# EAGLE board n64adv2 (EAGLE 9.1.3)
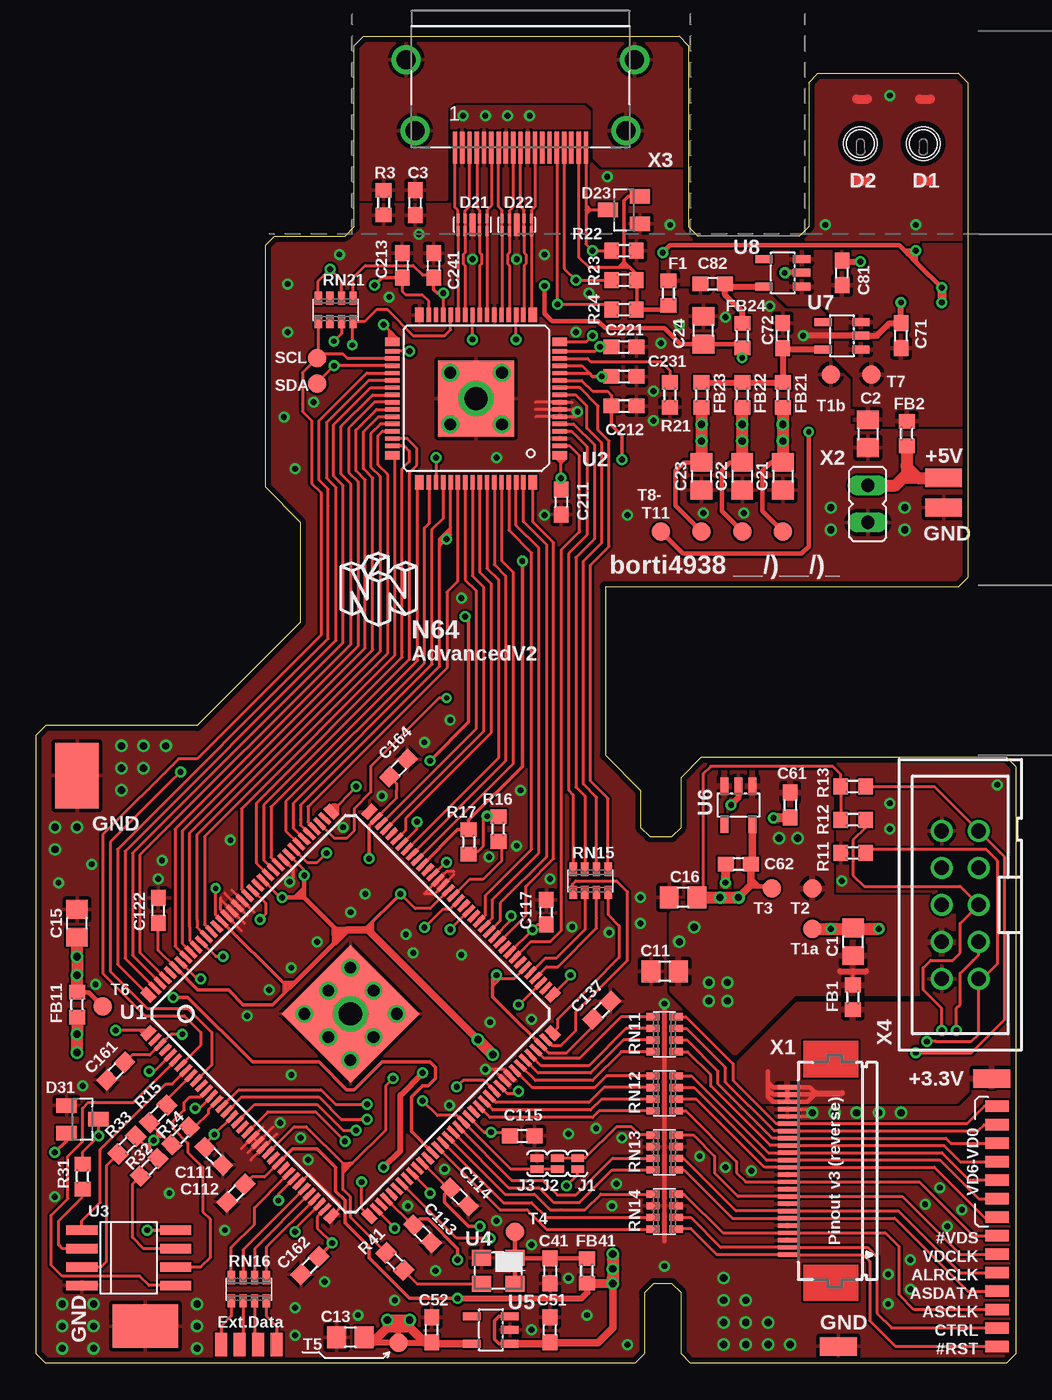
[diagram p4: board, top side]
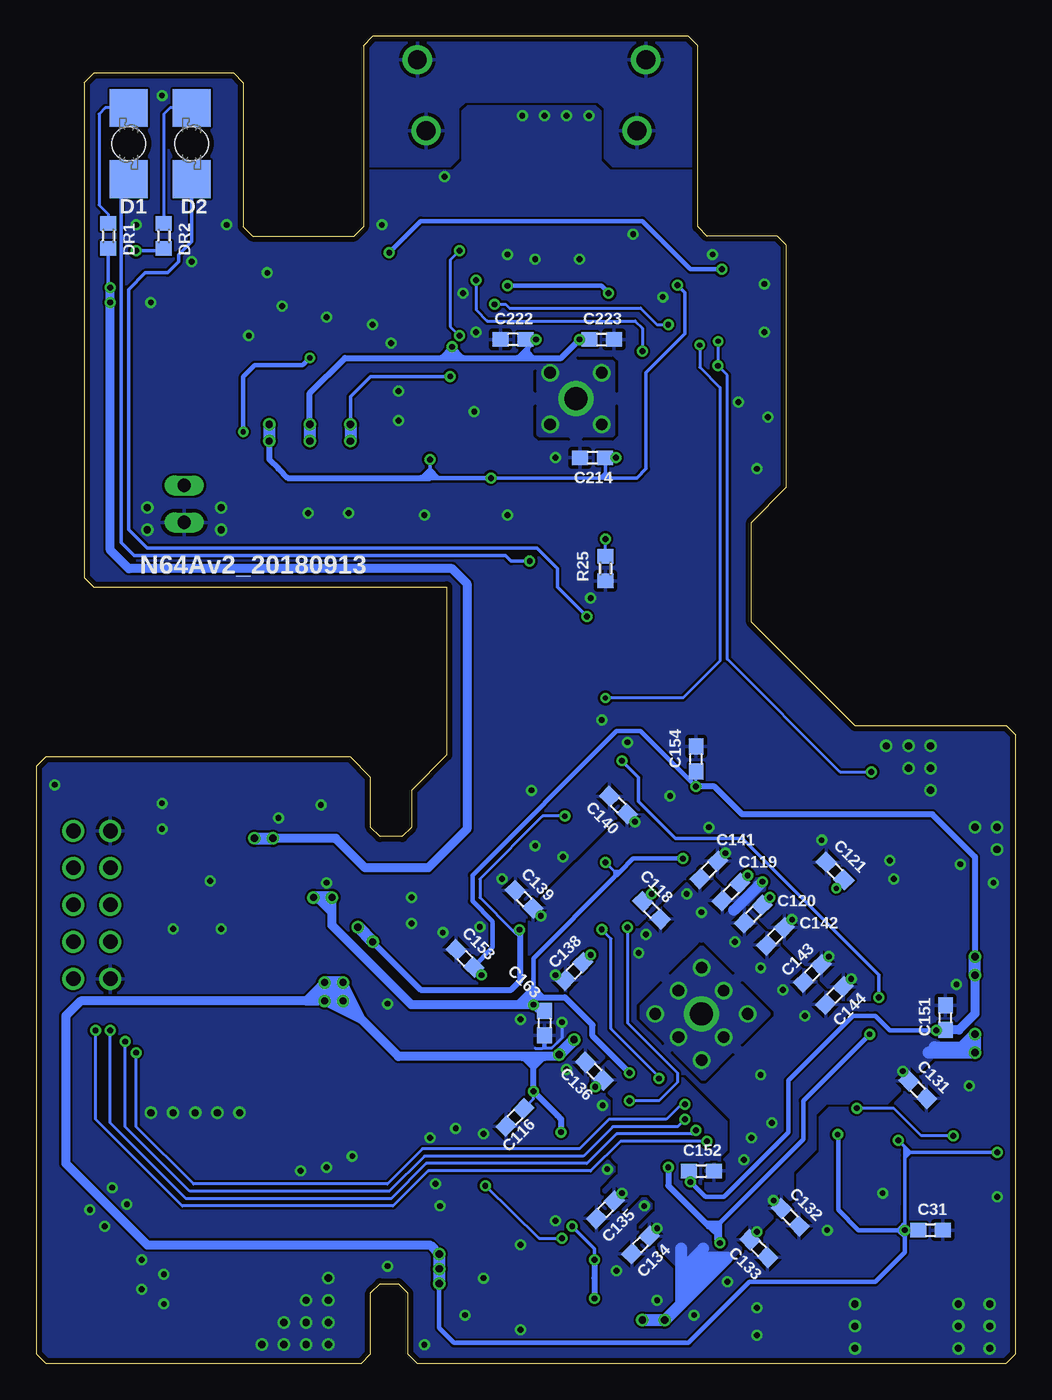
[diagram p5: board, bottom side, seen from below]

Size 67.31 x 91.19 mm. Coordinates in mm from the lower left corner, seen from the top.
Outline: 41.15,0 0.64,0 0,0.64 0,43.18 0.64,43.81 11.05,43.81 18.16,50.93 18.16,57.78 15.75,60.2 15.75,76.83 16.38,77.47 21.21,77.47 21.84,78.11 21.84,90.55 22.48,91.19 44.2,91.19 44.83,90.55 44.83,78.11 45.47,77.47 52.45,77.47 53.09,78.11 53.09,88.01 53.72,88.65 63.37,88.65 64.01,88.01 64.01,53.98 63.37,53.34 39.12,53.34 39.12,41.78 41.53,39.37 41.53,36.83 42.16,36.2 43.69,36.2 44.32,36.83 44.32,40.26 45.72,41.66 66.67,41.66 67.31,41.02 67.31,0.64 66.67,0 44.96,0 44.32,0.64 44.32,4.83 43.69,5.46 42.42,5.46 41.78,4.83 41.78,0.64 41.15,0
Copper layers (1*16): Top 0.0356mm / dielectric 1.5011mm / Bottom 0.0356mm
Design rules "LaenPCBOrder": minimum track width 6mil, minimum drill 13mil, track to track 6mil, track to pad 6mil, pad to pad 6mil, via to via 6mil, smd to smd 6mil, copper to edge 15mil, drill to drill 6mil, minimum pad ring 7mil, minimum via ring 7mil, stop-mask expansion 3mil, vias tented up to drill 30mil, thermal gap 10mil
bRestrict: 22 lines

## Footprints (pad centres in the part's own frame; a part is rotated, then mirrored left to right if it is on the bottom)
SMD1,27-2,54 = smd 1.27 x 2.54: 1 0,0
SMD0,8-1,6 = smd 0.8 x 1.6: P$1 0,0
C0805 = smd 1.3 x 1.5: 1 -0.95,0; 2 0.95,0
C0603 = smd 1.1 x 1: 1 -0.85,0; 2 0.85,0
P47F-BOTTOM = smd 2.6 x 2.6: A -2.45,0; C 2.45,0 | hole 2.3: 0,0
HDMI_RCLAMP = smd 0.2 x 0.675: 1 -1,-0.438; 2 -0.5,-0.438; 4 0.5,-0.438; 5 1,-0.438; 6 1,0.438; 7 0.5,0.438; 9 -0.5,0.438; 10 -1,0.438 | smd 0.4 x 1.55: 3 0,0
SOT23 = smd 1 x 1.4: 1 -0.95,-1.1; 2 0.95,-1.1; 3 0,1.1
R0603 = smd 1 x 1.1: 1 -0.85,0; 2 0.85,0
SJ_SMALL = smd 0.508 x 0.889: 1 -0.381,0; 2 0.381,0
CTS742C083 = smd 0.5 x 0.9: 1 -1.2,-0.8; 2 -0.4,-0.8; 3 0.4,-0.8; 4 1.2,-0.8; 5 1.2,0.8; 6 0.4,0.8; 7 -0.4,0.8; 8 -1.2,0.8
GND_FINGER_PAD = smd 4.5 x 3: P$1 0,0
B1,27 = smd 1.27 x 1.27: TP 0,0
EQFP144_2 = smd 1 x 0.6: 1 -10.75,8.9; 36 -10.75,-8.9; 73 10.75,-8.9; 108 10.75,8.9 | smd 1 x 0.3: 2 -10.75,8.25; 3 -10.75,7.75; 4 -10.75,7.25; 5 -10.75,6.75; 6 -10.75,6.25; 7 -10.75,5.75; 8 -10.75,5.25; 9 -10.75,4.75; 10 -10.75,4.25; 11 -10.75,3.75; 12 -10.75,3.25; 13 -10.75,2.75; 14 -10.75,2.25; 15 -10.75,1.75; 16 -10.75,1.25; 17 -10.75,0.75; 18 -10.75,0.25; 19 -10.75,-0.25; 20 -10.75,-0.75; 21 -10.75,-1.25; 22 -10.75,-1.75; 23 -10.75,-2.25; 24 -10.75,-2.75; 25 -10.75,-3.25; 26 -10.75,-3.75; 27 -10.75,-4.25; 28 -10.75,-4.75; 29 -10.75,-5.25; 30 -10.75,-5.75; 31 -10.75,-6.25; 32 -10.75,-6.75; 33 -10.75,-7.25; 34 -10.75,-7.75; 35 -10.75,-8.25; 74 10.75,-8.25; 75 10.75,-7.75; 76 10.75,-7.25; 77 10.75,-6.75; 78 10.75,-6.25; 79 10.75,-5.75; 80 10.75,-5.25; 81 10.75,-4.75; 82 10.75,-4.25; 83 10.75,-3.75; 84 10.75,-3.25; 85 10.75,-2.75; 86 10.75,-2.25; 87 10.75,-1.75; 88 10.75,-1.25; 89 10.75,-0.75; 90 10.75,-0.25; 91 10.75,0.25; 92 10.75,0.75; 93 10.75,1.25; 94 10.75,1.75; 95 10.75,2.25; 96 10.75,2.75; 97 10.75,3.25; 98 10.75,3.75; 99 10.75,4.25; 100 10.75,4.75; 101 10.75,5.25; 102 10.75,5.75; 103 10.75,6.25; 104 10.75,6.75; 105 10.75,7.25; 106 10.75,7.75; 107 10.75,8.25 | smd 0.6 x 1: 37 -8.9,-10.75; 72 8.9,-10.75; 109 8.9,10.75; 144 -8.9,10.75 | smd 0.3 x 1: 38 -8.25,-10.75; 39 -7.75,-10.75; 40 -7.25,-10.75; 41 -6.75,-10.75; 42 -6.25,-10.75; 43 -5.75,-10.75; 44 -5.25,-10.75; 45 -4.75,-10.75; 46 -4.25,-10.75; 47 -3.75,-10.75; 48 -3.25,-10.75; 49 -2.75,-10.75; 50 -2.25,-10.75; 51 -1.75,-10.75; 52 -1.25,-10.75; 53 -0.75,-10.75; 54 -0.25,-10.75; 55 0.25,-10.75; 56 0.75,-10.75; 57 1.25,-10.75; 58 1.75,-10.75; 59 2.25,-10.75; 60 2.75,-10.75; 61 3.25,-10.75; 62 3.75,-10.75; 63 4.25,-10.75; 64 4.75,-10.75; 65 5.25,-10.75; 66 5.75,-10.75; 67 6.25,-10.75; 68 6.75,-10.75; 69 7.25,-10.75; 70 7.75,-10.75; 71 8.25,-10.75; 110 8.25,10.75; 111 7.75,10.75; 112 7.25,10.75; 113 6.75,10.75; 114 6.25,10.75; 115 5.75,10.75; 116 5.25,10.75; 117 4.75,10.75; 118 4.25,10.75; 119 3.75,10.75; 120 3.25,10.75; 121 2.75,10.75; 122 2.25,10.75; 123 1.75,10.75; 124 1.25,10.75; 125 0.75,10.75; 126 0.25,10.75; 127 -0.25,10.75; 128 -0.75,10.75; 129 -1.25,10.75; 130 -1.75,10.75; 131 -2.25,10.75; 132 -2.75,10.75; 133 -3.25,10.75; 134 -3.75,10.75; 135 -4.25,10.75; 136 -4.75,10.75; 137 -5.25,10.75; 138 -5.75,10.75; 139 -6.25,10.75; 140 -6.75,10.75; 141 -7.25,10.75; 142 -7.75,10.75; 143 -8.25,10.75 | smd 6.7 x 6.7: E 0,0
LQFP64_EP = smd 1 x 0.6: 1 -5.75,3.9; 16 -5.75,-3.9; 33 5.75,-3.9; 48 5.75,3.9 | smd 1 x 0.3: 2 -5.75,3.25; 3 -5.75,2.75; 4 -5.75,2.25; 5 -5.75,1.75; 6 -5.75,1.25; 7 -5.75,0.75; 8 -5.75,0.25; 9 -5.75,-0.25; 10 -5.75,-0.75; 11 -5.75,-1.25; 12 -5.75,-1.75; 13 -5.75,-2.25; 14 -5.75,-2.75; 15 -5.75,-3.25; 34 5.75,-3.25; 35 5.75,-2.75; 36 5.75,-2.25; 37 5.75,-1.75; 38 5.75,-1.25; 39 5.75,-0.75; 40 5.75,-0.25; 41 5.75,0.25; 42 5.75,0.75; 43 5.75,1.25; 44 5.75,1.75; 45 5.75,2.25; 46 5.75,2.75; 47 5.75,3.25 | smd 0.6 x 1: 17 -3.9,-5.75; 32 3.9,-5.75; 49 3.9,5.75; 64 -3.9,5.75 | smd 0.3 x 1: 18 -3.25,-5.75; 19 -2.75,-5.75; 20 -2.25,-5.75; 21 -1.75,-5.75; 22 -1.25,-5.75; 23 -0.75,-5.75; 24 -0.25,-5.75; 25 0.25,-5.75; 26 0.75,-5.75; 27 1.25,-5.75; 28 1.75,-5.75; 29 2.25,-5.75; 30 2.75,-5.75; 31 3.25,-5.75; 50 3.25,5.75; 51 2.75,5.75; 52 2.25,5.75; 53 1.75,5.75; 54 1.25,5.75; 55 0.75,5.75; 56 0.25,5.75; 57 -0.25,5.75; 58 -0.75,5.75; 59 -1.25,5.75; 60 -1.75,5.75; 61 -2.25,5.75; 62 -2.75,5.75; 63 -3.25,5.75 | smd 5.2 x 5.2: EXP 0,0
SO8-DUAL = smd 2.159 x 0.635: 1 -3.226,1.905; 2 -3.226,0.635; 3 -3.226,-0.635; 4 -3.226,-1.905; 5 3.226,-1.905; 6 3.226,-0.635; 7 3.226,0.635; 8 3.226,1.905
3.2X2.5_KXO-V96 = smd 1.3 x 1.1: 1 -1.15,-0.9; 2 1.15,-0.9; 3 1.15,0.9; 4 -1.15,0.9
SOT23-5 = smd 0.55 x 1.2: 1 -0.95,-1.3; 2 0,-1.3; 3 0.95,-1.3; 4 0.95,1.3; 5 -0.95,1.3
FH12-24S-0.5SH = smd 0.3 x 1.3: 1 -5.75,3.25; 2 -5.25,3.25; 3 -4.75,3.25; 4 -4.25,3.25; 5 -3.75,3.25; 6 -3.25,3.25; 7 -2.75,3.25; 8 -2.25,3.25; 9 -1.75,3.25; 10 -1.25,3.25; 11 -0.75,3.25; 12 -0.25,3.25; 13 0.25,3.25; 14 0.75,3.25; 15 1.25,3.25; 16 1.75,3.25; 17 2.25,3.25; 18 2.75,3.25; 19 3.25,3.25; 20 3.75,3.25; 21 4.25,3.25; 22 4.75,3.25; 23 5.25,3.25; 24 5.75,3.25
JP1 = drill 0.914 long: 1 0,-1.27; 2 0,1.27
685119134923 = smd 0.3 x 2.2: 1 4.5,0.15; 2 4,0.15; 3 3.5,0.15; 4 3,0.15; 5 2.5,0.15; 6 2,0.15; 7 1.5,0.15; 8 1,0.15; 9 0.5,0.15; 10 0,0.15; 11 -0.5,0.15; 12 -1,0.15; 13 -1.5,0.15; 14 -2,0.15; 15 -2.5,0.15; 16 -3,0.15; 17 -3.5,0.15; 18 -4,0.15; 19 -4.5,0.15 | drill 1.3 pad 2: SHELL -7.25,-1; SHELL1 7.25,-1; SHELL2 -7.85,-5.9; SHELL3 7.85,-5.9
PAK100/2500-10 = drill 1 pad 1.422: 1 -5.08,-1.27; 2 -5.08,1.27; 3 -2.54,-1.27; 4 -2.54,1.27; 5 0,-1.27; 6 0,1.27; 7 2.54,-1.27; 8 2.54,1.27; 9 5.08,-1.27; 10 5.08,1.27

## Placement (x,y rotation side)
3V_IN  [SMD1,27-2,54]  65.66,19.56 90 top
#RST  [SMD0,8-1,6]  66.04,1.14 90 top
#VDS  [SMD0,8-1,6]  66.04,8.76 270 top
ALRCLK  [SMD0,8-1,6]  66.04,6.22 270 top
ASCLK  [SMD0,8-1,6]  66.04,3.68 270 top
ASDATA  [SMD0,8-1,6]  66.04,4.95 270 top
C1  47u  [C0805]  56.13,28.96 90 top
C2  47u  [C0805]  57.15,63.88 270 top
C3  0.1u  [C0603]  26.04,79.76 90 top
C11  10u  [C0805]  43.18,26.92 180 top
C13  10u  [C0805]  21.59,1.78 180 top
C15  10u  [C0805]  2.79,30.23 90 top
C16  10u  [C0805]  44.45,32 180 top
C21  10u  [C0805]  51.31,60.96 270 top
C22  10u  [C0805]  48.51,60.96 270 top
C23  10u  [C0805]  45.72,60.96 270 top
C24  10u  [C0805]  45.85,70.99 90 top
C31  0.1u  [C0603]  5.84,9.14 0 bottom
C41  0.01u  [C0603]  35.31,6.35 270 top
C51  1u  [C0603]  35.31,2.29 90 top
C52  1u  [C0603]  27.18,2.29 90 top
C61  1u  [C0603]  51.82,38.35 270 top
C62  1u  [C0603]  48.26,34.29 180 top
C71  1u  [C0603]  59.44,70.61 90 top
C72  1u  [C0603]  51.31,70.61 90 top
C81  1u  [C0603]  55.37,74.93 90 top
C82  1u  [C0603]  46.48,74.17 180 top
C111  0.1u  [C0603]  12.19,14.22 315 top
C112  0.1u  [C0603]  13.72,11.68 225 top
C113  0.1u  [C0603]  26.54,8.89 315 top
C114  0.1u  [C0603]  29.08,11.43 315 top
C115  0.1u  [C0603]  33.4,15.62 0 top
C116  0.1u  [C0603]  34.42,16.89 225 bottom
C117  0.1u  [C0603]  35.05,30.99 90 top
C118  0.1u  [C0603]  25.02,31.11 315 bottom
C119  0.1u  [C0603]  19.56,32.38 225 bottom
C120  0.1u  [C0603]  18.03,30.86 225 bottom
C121  0.1u  [C0603]  12.41,33.82 135 bottom
C122  0.1u  [C0603]  8.38,31.11 90 top
C131  0.1u  [C0603]  6.73,18.8 315 bottom
C132  0.1u  [C0603]  15.49,10.03 315 bottom
C133  0.1u  [C0603]  17.65,7.87 315 bottom
C134  0.1u  [C0603]  25.78,8.13 225 bottom
C135  0.1u  [C0603]  28.19,10.54 225 bottom
C136  0.1u  [C0603]  28.96,20.07 135 bottom
C137  0.1u  [C0603]  38.86,24.26 45 top
C138  0.1u  [C0603]  30.35,26.92 45 bottom
C139  0.1u  [C0603]  33.78,31.88 135 bottom
C140  0.1u  [C0603]  27.3,38.35 135 bottom
C141  0.1u  [C0603]  21.08,33.91 225 bottom
C142  0.1u  [C0603]  16.51,29.34 225 bottom
C143  0.1u  [C0603]  13.97,26.8 225 bottom
C144  0.1u  [C0603]  12.45,25.27 225 bottom
C151  0.1u  [C0603]  4.83,23.75 90 bottom
C152  0.1u  [C0603]  21.59,13.21 0 bottom
C153  0.1u  [C0603]  37.85,27.81 135 bottom
C154  0.1u  [C0603]  21.97,41.53 90 bottom
C161  0.1u  [C0603]  5.46,20.07 225 top
C162  0.1u  [C0603]  18.8,6.71 225 top
C163  0.1u  [C0603]  32.38,23.37 270 bottom
C164  0.1u  [C0603]  24.89,40.89 45 top
C211  0.1u  [C0603]  36.07,59.18 270 top
C212  0.1u  [C0603]  40.39,65.79 0 top
C213  0.1u  [C0603]  25.15,75.44 90 top
C214  0.1u  [C0603]  29.08,62.23 180 bottom
C221  0.1u  [C0603]  40.39,69.85 0 top
C222  0.1u  [C0603]  34.54,70.36 180 bottom
C223  0.1u  [C0603]  28.45,70.36 0 bottom
C231  0.1u  [C0603]  40.39,67.82 0 top
C241  0.1u  [C0603]  27.3,75.44 90 top
CTRL  [SMD0,8-1,6]  66.04,2.41 90 top
D1  LRP4-BOTTOM  [P47F-BOTTOM]  60.96,83.82 270 bottom
D2  LRP4-BOTTOM  [P47F-BOTTOM]  56.64,83.82 270 bottom
D21  RCLAMP0524PATCT  [HDMI_RCLAMP]  29.97,78.23 0 top
D22  RCLAMP0524PATCT  [HDMI_RCLAMP]  33.02,78.23 180 top
D23  BAT 64-04  [SOT23]  40.39,79.25 90 top
D31  BAT 64-04  [SOT23]  3.17,16.76 270 top
DR1  330  [R0603]  62.36,77.47 270 bottom
DR2  330  [R0603]  58.55,77.47 270 bottom
ED0  [SMD0,8-1,6]  12.7,1.27 0 top
ED1  [SMD0,8-1,6]  13.97,1.27 0 top
ED2  [SMD0,8-1,6]  15.24,1.27 0 top
ED3  [SMD0,8-1,6]  16.51,1.27 0 top
F1  [R0603]  43.43,73.53 270 top
FB1  MPZ1608S221A  [R0603]  56.13,25.15 90 top
FB2  MPZ1608S221A  [R0603]  59.82,63.88 90 top
FB11  MPZ1608S221A  [R0603]  2.79,24.64 90 top
FB21  MPZ1608S221A  [R0603]  51.31,66.55 270 top
FB22  MPZ1608S221A  [R0603]  48.51,66.55 270 top
FB23  MPZ1608S221A  [R0603]  45.72,66.55 270 top
FB24  MPZ1608S221A  [R0603]  48.51,70.61 270 top
FB41  MPZ1608S221A  [R0603]  37.85,6.35 90 top
J1  [SJ_SMALL]  37.21,13.72 90 top
J2  [SJ_SMALL]  35.81,13.72 90 top
J3  [SJ_SMALL]  34.42,13.72 90 top
P_5V_IN  [SMD1,27-2,54]  62.36,60.83 270 top
P_GND_1  [SMD1,27-2,54]  55.12,1.14 270 top
P_GND_2  [SMD1,27-2,54]  62.36,58.8 90 top
R3  1M  [R0603]  23.88,79.76 90 top
R11  1k  [R0603]  56.13,35.05 180 top
R12  10k  [R0603]  56.13,37.34 180 top
R13  10k  [R0603]  56.13,39.62 180 top
R14  10k  [R0603]  9.91,15.62 45 top
R15  10k  [R0603]  8.38,17.14 45 top
R16  10k  [R0603]  31.75,36.7 90 top
R17  10k  [R0603]  29.72,35.81 270 top
R21  887  [R0603]  43.56,66.55 90 top
R22  10k  [R0603]  40.39,76.45 180 top
R23  2k  [R0603]  40.39,74.42 180 top
R24  2k  [R0603]  40.39,72.39 180 top
R25  50  [R0603]  28.19,54.61 270 bottom
R31  25  [R0603]  3.17,12.83 90 top
R32  4k7  [R0603]  7.75,13.46 45 top
R33  4k7  [R0603]  6.22,14.99 225 top
R41  25  [R0603]  24.64,6.99 315 top
RN11  BK32164M121-T  [CTS742C083]  43.18,22.61 270 top
RN12  BK32164M121-T  [CTS742C083]  43.18,18.54 270 top
RN13  BK32164M121-T  [CTS742C083]  43.18,14.48 270 top
RN14  BK32164M121-T  [CTS742C083]  43.18,10.41 270 top
RN15  CAT16-49R9F4LF  [CTS742C083]  38.1,33.15 180 top
RN16  CAT16-49R9F4LF  [CTS742C083]  14.61,5.08 180 top
RN21  CAT16-2001F4LF  [CTS742C083]  20.57,72.39 0 top
SF_GND_1  PADSHIELD_FINGER  [GND_FINGER_PAD]  2.79,40.39 90 top
SF_GND_2  PADSHIELD_FINGER  [GND_FINGER_PAD]  7.49,2.54 180 top
TP_5V  TPB1,27  [B1,27]  57.4,67.94 0 top
TP_AVDD  TPB1,27  [B1,27]  48.51,57.15 0 top
TP_DVDD  TPB1,27  [B1,27]  51.31,57.15 0 top
TP_DVDD_3V3  TPB1,27  [B1,27]  42.93,57.15 0 top
TP_GND1  TPB1,27  [B1,27]  53.34,29.84 0 top
TP_GND2  TPB1,27  [B1,27]  54.61,67.94 0 top
TP_PVDD  TPB1,27  [B1,27]  45.72,57.15 0 top
TP_SCL  TPB1,27  [B1,27]  19.3,69.09 0 top
TP_SDA  TPB1,27  [B1,27]  19.3,67.31 0 top
TP_VCC_U4  TPB1,27  [B1,27]  32.89,9.02 0 top
TP_VCCA  TPB1,27  [B1,27]  50.55,32.64 0 top
TP_VCCD_PLL  TPB1,27  [B1,27]  4.57,24.51 0 top
TP_VCCINT  TPB1,27  [B1,27]  24.89,1.4 0 top
TP_VCCIO  TPB1,27  [B1,27]  53.34,32.64 0 top
U1  10CL025YE144  [EQFP144_2]  21.59,24 45 top
U2  ADV7513  [LQFP64_EP]  30.23,66.29 180 top
U3  S25FLXXXSO8-DUAL  [SO8-DUAL]  6.35,7.24 0 top
U4  27M  [3.2X2.5_KXO-V96]  31.75,6.35 180 top
U5  TLV70212DBVT  [SOT23-5]  31.24,2.29 90 top
U6  TLV70225DBVT  [SOT23-5]  48.26,38.35 180 top
U7  TLV70218DBVT  [SOT23-5]  55.37,70.61 90 top
U8  TLV70033  [SOT23-5]  51.31,74.93 90 top
VD0  [SMD0,8-1,6]  66.04,17.65 270 top
VD1  [SMD0,8-1,6]  66.04,16.38 270 top
VD2  [SMD0,8-1,6]  66.04,15.11 270 top
VD3  [SMD0,8-1,6]  66.04,13.84 270 top
VD4  [SMD0,8-1,6]  66.04,12.57 270 top
VD5  [SMD0,8-1,6]  66.04,11.3 270 top
VD6  [SMD0,8-1,6]  66.04,10.03 270 top
VDCLK  [SMD0,8-1,6]  66.04,7.49 270 top
X1  FH12-24S-0.5SH  [FH12-24S-0.5SH]  54.86,13.21 90 top
X2  [JP1]  57.15,59.05 180 top
X3  hdmi-con  [685119134923]  33.27,83.69 180 top
X4  [PAK100/2500-10]  63.5,31.5 90 top

## Tracks (layer width: path | path; a pad name or v marks a point on that pad's centre or on a via)
1.8V_PRE
  Top 0.406: U7.5 51.41,69.66 C72.1 FB21.1 FB22.1 FB23.1
3.3V_PRE
  Top 0.203: C82.1 47.33,73.99 47.34,73.98
  Top 0.406: U8.5 47.34,73.98 47.34,73.43 48.51,72.26 FB24.1
3V_IN
  Top 0.292: X1.22 50.62,17.96 50.29,18.29 50.29,18.8 | 50.29,18.8 50.29,19.3 | 50.29,19.3 50.29,20.07 | X1.22 X1.23 | X1.23 50.63,18.46 50.29,18.8 | X1.24 X1.23 | X1.24 50.64,18.96 50.29,19.3 | X1.24 53.18,18.96 53.59,18.54 53.51,18.46 | X1.23 53.51,18.46 | X1.22 53.01,17.96 53.51,18.46
  Top 0.406: 53.59,18.54 55.37,18.54
  pour Top: 64.26,19.05 66.93,19.05 66.93,21.34 66.93,24.64 52.32,24.64 47.75,20.07 47.75,18.03 63.25,18.03
5V_IN
  Top 0.813: FB2.1 59.82,61.72 | 59.82,61.72 59.82,61.59 60.58,60.83 | 60.58,60.83 P_5V_IN.1 | 60.58,60.83 59.56,60.83 | 59.82,61.72 59.82,61.09 59.31,60.58 59.05,60.33 X2.1
+5V
  pour Top (rank 5): 43.05,74.17 43.05,76.83 65.41,76.83 65.41,64.52 56.26,64.52 56.26,67.82 54.99,69.09 54.99,71.88 54.1,72.77 51.69,72.77 51.05,73.41 50.29,74.17
AVDD  (via drill 0.4, 0.5)
  Top 0.203: v29.98,70.36 U2.25 | v32.98,70.36 32.98,70.44 U2.19 | U2.15 38.43,69.54 v38.73,69.85 C221.1
  Top 0.305: C22.1 47.69,61.91 47.12,61.34 47.12,58.55 TP_AVDD.TP
  Top 0.813: C22.1 v48.51,63.37 v48.51,64.52 FB22.2
  Bottom 0.203: C223.1 v29.98,70.36 | C222.1 v32.98,70.36
  Bottom 0.305: 34.25,69.09 v32.98,70.36 | 37.97,69.09 v38.73,69.85 39.5,69.09 | 38.35,69.09 38.73,69.47 | 38.73,69.47 38.73,69.6 | 38.73,69.47 39.12,69.09 | 33.15,69.09 33.53,69.47 | 33.53,69.47 33.53,69.85 | 33.53,69.47 33.91,69.09
  Bottom 0.406: v48.51,64.52 48.51,66.67 46.1,69.09 39.5,69.09 39.37,69.09 39.12,69.09 38.35,69.09 37.97,69.09 34.25,69.09 33.91,69.09 33.15,69.09 31.25,69.09 v29.98,70.36
  Bottom 0.813: v48.51,64.52 v48.51,63.37
DVDD  (via drill 0.4, 0.5)
  Top 0.203: C213.1 25.15,73.66 25.4,73.41 26.54,73.41 26.98,72.97 U2.31 | v27.48,62.23 27.48,62.19 U2.51 | C211.1 v36.07,60.83 36.07,61.85 | 36.07,61.85 36.07,62.3 U2.1 | 36.07,61.85 35.69,62.23 | 36.07,61.85 36.32,62.1 36.32,62.36 | U2.11 37.48,67.54 38.23,66.8 39.24,66.8 39.54,66.51 C212.1
  Top 0.254: C212.1 39.54,64.48 40.26,63.75 v40.26,62.1 | v23.24,74.08 23.75,74.59 C213.1
  Top 0.305: C21.1 50.48,61.91 49.91,61.34 49.91,58.55 TP_DVDD.TP
  Top 0.813: FB21.2 v51.31,64.52 v51.31,63.37 C21.1
  Bottom 0.203: C214.1 28.19,62.23 v27.48,62.23
  Bottom 0.254: v36.07,60.83 28.57,60.83 | 28.57,60.83 28.19,60.83 | 28.19,60.83 27.81,60.83 | 27.81,60.83 26.04,60.83 25.4,61.47 25.4,68.07 22.73,70.74 22.73,73.57 v23.24,74.08 | v40.26,62.1 40.26,61.47 | 40.26,61.47 40.26,61.21 | 40.26,61.21 40.26,60.83 | 40.26,61.47 40.89,60.83 40.64,60.83 40.39,61.09 | 40.26,61.47 39.62,60.83 39.88,60.83 40.26,61.21 | 28.19,60.83 28.19,61.21 | 28.19,61.21 28.19,62.23 | 28.19,61.21 27.81,60.83 | 27.81,60.83 28.57,60.83 | 28.57,60.83 28.19,61.21
  Bottom 0.305: 40.26,60.83 39.62,60.83 v36.07,60.83
  Bottom 0.406: v51.31,63.37 51.31,62.1 50.67,61.47 50.04,60.83 40.89,60.83 40.26,60.83
  Bottom 0.813: v51.31,64.52 v51.31,63.37
DVDD_3V3  (via drill 0.35, 0.4)
  Top 0.203: U2.29 v27.98,73.53 | RN21.5 21.77,74.61 22.61,75.44 25.91,75.44 26.54,74.8 27.09,74.8 C241.1
  Top 0.254: 48.23,70.04 FB24.2 | v27.98,73.53 27.56,73.53 27.3,73.79 C241.1
  Top 0.305: 48.23,70.04 C24.1 44.26,70.04 43.18,71.12 39.12,71.12 38.61,71.63 35.43,71.63 34.92,72.14 v34.92,74.04 | TP_DVDD_3V3.TP 44.45,55.63 52.58,55.63 53.09,56.13 v53.09,64.01 | v48.51,69.09 FB24.2
  Bottom 0.305: v34.92,74.04 28.48,74.04 v27.98,73.53 | v53.09,64.01 53.09,67.82 52.32,68.58 49.02,68.58 v48.51,69.09
GND  (via drill 0.4, 0.5, 0.8, 1.6)
  Top 0.203: 14.11,29.72 U1.129 12.68,31.15 12.68,31.99 | 14.31,30.23 U1.128 12.7,31.83 | 14.48,30.76 U1.127 12.95,32.28 | 14.96,30.99 U1.126 13.44,32.51 | 28.7,33.78 28.19,33.78 U1.95 26.67,32.27 26.67,32.26 27.37,32.26 U1.94 28.7,33.59 | U1.63 31.41,20.19 v30.86,20.19 32.12,20.19 U1.64 | 14.73,13.97 U1.23 16.52,15.75 | U1.22 14.54,14.48 | U1.22 16.29,16.23 | 34.31,65.04 U2.6 37.06,65.04 | 34.28,65.54 U2.7 36.84,65.54 | 34.29,66.04 U2.8 36.83,66.04 | C1.2 56.13,29.84 | U1.36 20.83,10.65 20.83,10.92 18.8,12.95 18.67,12.95 U1.30 | U1.21 14.09,14.73 | U1.21 15.58,16.23 | U1.21 U1.22
  Top 0.254: U1.118 17.65,33.95 17.65,33.34 v17.4,33.08 | X1.21 53.09,17.46 v53.34,17.21 53.09,16.96 X1.20
  Top 0.305: 43.18,8.38 43.18,24.89
  Top 0.406: U6.2 48.26,38.86 v47.75,38.35 | v52.7,70.61 U7.2 57.78,70.61 58.63,71.46 C71.2 v59.44,72.9 | U8.2 v51.44,74.93 | C81.2 55.41,75.78 55.5,75.69 v56.64,75.69
  Top 0.61: C61.2 51.78,37.47 v50.67,37.47 | C62.2 47.37,34.25 v47.37,33.02 | 56.39,86.87 57.15,86.87 | 60.71,86.87 61.47,86.87 | 60.71,81.28 61.47,81.28 | 56.39,81.28 57.15,81.28 | 60.71,86.87 61.47,86.87 | 60.71,81.28 61.47,81.28 | 56.39,81.28 57.15,81.28 | 60.71,86.87 61.47,86.87 | 60.71,81.28 61.47,81.28 | 56.39,81.28 57.15,81.28 | 60.71,86.87 61.47,86.87 | 60.71,81.28 61.47,81.28 | 56.39,81.28 57.15,81.28
  Top 0.813: v57.91,29.84 56.13,29.84 v54.61,29.84 TP_GND1.TP
  Bottom 0.203: v31.18,23.43 31.18,22.36 31.9,21.64 32.51,21.64 33.02,21.64
  Bottom 0.305: C163.2 32.38,21.69
  Bottom 0.406: C138.2 v29.21,28.07
  Bottom 0.762: v17.4,33.08 17.68,32.8 18.77,31.71 19.37,31.11
  other vias: 49.15,13.21 47.37,13.46 45.59,14.22 62.1,12.06 61.09,10.92 60.07,7.11 58.55,6.1 62.61,9.4 63.63,10.54 60.07,5.08 58.55,4.06 30.23,66.29 21.59,24 28.45,64.52 28.45,68.07 32,68.07 32,64.52 1.78,4.06 1.78,2.54 1.78,1.02 3.94,1.02 3.94,2.54 3.94,4.06 11.05,1.02 11.05,2.54 11.05,4.06 47.24,4.32 47.24,5.84 47.24,1.27 48.77,1.27 50.29,1.27 51.82,1.27 48.77,4.32 50.29,2.79 48.77,2.79 47.24,2.79 5.84,40.89 5.84,42.42 7.37,42.42 7.37,40.89 5.84,39.37 8.89,42.42 2.79,36.83 1.27,36.83 1.27,35.31 54.86,17.21 56.39,17.21 57.91,17.21 59.44,17.21 59.69,58.8 54.61,58.8 54.61,57.28 59.69,57.28 21.59,27.18 18.41,24 24.77,24 21.59,20.83 20.07,25.59 20.07,22.42 23.18,22.42 23.18,25.59 33.02,35.56 26.67,42.67 28.45,44.2 31.11,34.8 22.61,32.26 21.59,30.99 19.3,28.96 17.53,27.18 16,25.65 14.48,23.88 8.38,33.27 8.64,34.54 1.52,33.02 3.81,34.29 4.06,26.04 12.95,9.14 1.27,11.43 27.43,6.35 31.62,9.78 36.58,5.84 34.04,8.13 34.04,2.29 37.85,3.3 24.64,4.32 36.58,15.75 38.48,16.13 43.18,24.7 34.04,23.62 39.37,29.59 55.37,33.15 41.53,32 41.53,30.23 19.05,66.04 20.83,76.2 29.97,75.88 33.02,75.88 26.29,77.6 24.26,73.28 44.2,71.37 47.37,71.88 50.42,72.64 37.08,70.87 42.42,64.77 42.42,66.8 45.85,58.42 48.64,58.42 34.92,58.29 39.24,81.53 29.34,85.72 30.86,85.72 32.38,85.72 33.91,85.72 25.91,28.19 37.21,65.41 23.75,38.99 58.67,38.48 58.67,36.7 66.04,39.75 25.4,29.46 39.88,12.32 28.38,17.72 3.17,19.05 18.67,13.97 31.62,62.23 42.93,70.1 17.27,74.17 22.1,3.3 19.81,5.59 39.56,10.79 43.18,6.67 17.78,3.81 17.78,1.91 40.64,1.27 40.64,58.29 18.16,15.49 16.76,16.51 25.53,10.79 28.07,13.34 34.92,76.2 40.26,15.49 29.21,52.58 33.27,39.37 35.31,33.27 17.53,19.81 43.56,78.23 37.97,73.53 13.34,35.94 21.08,36.83 9.14,11.68 36.83,29.97 54.23,78.23 60.45,78.23 58.67,87.12 17.27,70.87 17.02,65.02 17.78,61.47
  pour Bottom (rank 6): 0,0 67.31,0 67.31,92.2 0,92.2
  pour Bottom: 11.94,24.38 11.94,22.86 15.75,19.05 15.75,15.75 20.07,11.43 21.34,11.43 21.34,13.72 20.32,13.72 19.56,14.48 19.56,16.26 19.56,16.76 26.42,23.62 26.42,29.21 26.16,29.46 21.59,34.04
  pour Top (rank 6): 0,0 0,92.2 67.31,92.2 67.31,0
  pour Bottom: 9.02,14.73 9.02,17.53 12.83,17.53 13.46,16.89 13.46,14.48 14.99,12.95 14.99,8.89 14.73,8.64 11.05,8.64 10.54,9.14 10.54,13.21
  pour Bottom: 24.77,7.75 26.16,9.14 26.16,9.53 25.02,10.67 25.02,10.92 25.4,11.3 25.65,11.3 26.8,10.16 27.18,10.16 28.45,11.43 29.84,10.03 26.16,6.35
  pour Bottom: 27.3,10.29 28.7,11.68 28.7,12.06 27.56,13.21 27.56,13.46 27.94,13.84 28.19,13.84 30.92,11.11 28.7,8.89
  pour Bottom: 27.94,37.85 26.92,38.86 26.16,38.86 23.62,36.32 19.05,36.32 19.05,37.85 21.34,40.13 28.19,40.13 29.21,39.12
  pour Bottom: 35.81,14.73 35.81,25.15 31.75,25.15 27.94,21.34 29.59,19.68 27.94,18.03 27.94,14.73
  pour Bottom: 3.56,26.92 3.56,22.86 8.64,22.86 9.65,23.88 13.72,23.88 13.72,25.4 12.95,25.4 12.19,24.64 9.4,24.64 9.4,26.92
GND_HDMI_SHIELD
  pour Top: 28.19,80.01 28.19,86.23 28.7,86.74 31.62,86.74 37.85,86.74 38.35,86.23 38.35,83.57 38.35,82.8 38.86,82.3 44.96,82.3 44.96,91.19 21.97,91.19 21.97,80.01
  pour Bottom: 28.19,86.23 28.19,82.8 27.69,82.3 21.97,82.3 21.97,91.19 44.96,91.19 44.96,82.3 38.86,82.3 38.35,82.8 38.35,86.23 37.85,86.74 28.7,86.74
N$1
  Bottom 0.203: D1.A 62.57,86.27 62.99,85.85 62.99,79.59 62.36,78.95 DR1.1
N$2
  Top 0.203: U1.33 15.8,7.96 RN16.1
N$3
  Top 0.203: U1.32 15.01,7.87 RN16.2
N$4
  Top 0.203: U1.31 14.21,7.78 RN16.3
N$5
  Top 0.203: U1.28 17,12.7 14.99,10.68 14.99,9.53 13.4,7.94 RN16.4
N$6
  Top 0.203: RN16.5 13.4,3.25 12.7,2.54 ED0.P$1
N$7
  Top 0.203: RN16.6 14.21,1.5 ED1.P$1
N$8
  Top 0.203: RN16.7 15.01,1.5 ED2.P$1
N$9  (via drill 0.4)
  Top 0.203: v31.19,8.58 28.88,8.58 U1.43 | J1.1 37.21,12.95 v36.45,12.19
  Bottom 0.203: v36.45,12.19 32.76,8.58 v31.19,8.58
N$10
  Top 0.203: RN16.8 15.8,3.25 16.51,2.54 ED3.P$1
N$11
  Top 0.203: U1.71 35.42,21.84 36.07,21.84 37.08,22.86 37.08,24.13 40.64,27.69 40.64,32.38 39.88,33.15 37.08,33.15 36.85,32.91 36.85,32.4 RN15.5
N$12
  Top 0.203: RN15.6 37.7,29.8 35.74,27.85 34.98,27.85 U1.77
N$13  (via drill 0.4)
  Top 0.254: v9.4,25.15 10.41,25.15 14.86,20.7 19.43,20.7 21.34,18.8 21.84,18.8 23.75,20.7 27.05,20.7 27.43,20.32 27.43,19.56 26.92,19.05 26.54,19.05 25.78,18.29 25.78,15.92 U1.49 | v27.05,41.4 29.72,44.07 29.72,51.05 v29.46,51.31
  Bottom 0.254: v9.4,25.15 9.4,26.67 18.8,36.07 23.37,36.07 25.91,38.61 25.91,40.26 v27.05,41.4 | D2.C 56.64,77.47 56.64,77.09 57.53,76.2 57.53,75.69 58.29,74.93 59.82,74.93 60.96,73.79 60.96,57.28 59.69,56.01 32.89,56.01 31.5,54.61 31.5,53.34 v29.46,51.31
N$14
  Top 0.203: J2.2 J1.2 37.72,14.1 39.88,16.26 40.89,16.26 41.47,15.68 RN13.1
N$26
  Top 0.203: U2.63 33.48,57.84 35.05,56.26 35.05,34.8 31.88,31.62 31.88,30.4 U1.85
N$27
  Top 0.203: U2.64 34.13,57.82 35.56,56.39 35.56,34.67 33.66,32.77 33.66,30.77 U1.83
N$28
  Top 0.203: U2.2 36.65,63.04 37.34,62.36 37.34,57.15 36.07,55.88 36.07,39.02 36.07,29.72 35.31,28.96 33.97,28.96 U1.80
N$29
  Top 0.203: U2.4 36.79,64.04 37.85,62.99 37.85,56.9 36.58,55.63 36.58,39.38 36.9,39.06 RN15.4
N$30
  Top 0.203: U2.5 36.93,64.54 38.35,63.12 38.35,56.64 37.08,55.37 37.08,39.59 37.7,38.97 RN15.3
N$31
  Top 0.203: U2.9 37.09,66.54 37.85,65.79 37.85,64.26 38.86,63.25 38.86,56.39 37.59,55.12 37.59,39.79 38.5,38.88 RN15.2
N$32
  Top 0.203: U2.10 37.35,67.04 38.61,65.79 38.61,64.14 39.37,63.37 39.37,56.13 38.1,54.86 38.1,40.01 39.3,38.8 RN15.1
N$33  (via drill 0.4)
  Top 0.203: X3.19 37.77,79.25 | 37.77,79.25 37.77,76.91 v38.23,76.45 R22.2 | v38.23,70.61 37.81,70.19 U2.16 | D23.3 38.1,79.25 | 38.1,79.25 37.77,79.25 | 38.1,79.25 37.85,79.5 | 38.1,79.25 37.85,78.99
  Bottom 0.203: v38.23,76.45 38.86,75.82 38.86,71.25 v38.23,70.61
N$34
  Top 0.2: X3.12 34.27,79.49 34.02,79.23 D22.1 D22.10 34.02,72.15 U2.17
N$35
  Top 0.2: X3.10 33.27,79.48 33.52,79.23 D22.2 D22.9 33.52,76.33 33.66,76.2 33.66,75.56 33.52,75.43 33.52,72.09 U2.18
N$36
  Top 0.2: X3.9 32.77,79.46 32.52,79.2 D22.4 D22.7 32.52,76.33 32.38,76.2 32.38,75.56 32.51,75.44 32.51,72.08 U2.20 32.52,72.09
N$37
  Top 0.2: X3.7 31.77,79.48 32.02,79.23 D22.5 D22.6 32.02,72.09 U2.21
N$38
  Top 0.2: X3.6 31.27,79.53 30.97,79.23 D21.6 D21.5 U2.23
N$39
  Top 0.2: X3.4 30.27,79.43 30.48,79.22 D21.7 D21.4 30.47,76.33 30.61,76.2 30.61,75.56 30.47,75.43 U2.24
N$40
  Top 0.2: X3.3 29.77,79.51 29.47,79.2 D21.9 D21.2 29.47,76.33 29.34,76.2 29.34,75.56 29.46,75.44 29.46,72.06 U2.26
N$41
  Top 0.2: X3.1 28.77,79.43 28.97,79.23 D21.10 D21.1 U2.27
N$42  (via drill 0.4)
  Top 0.203: v26.54,18.03 27.56,17.02 28.93,17.02 U1.55 32.61,13.34 J3.1 J2.1 | v26.67,29.95 27.94,31.21 28.45,31.21 U1.91
  Bottom 0.203: v26.67,29.95 26.67,23.37 23.24,19.94 23.24,19.3 24.51,18.03 v26.54,18.03
N$43  (via drill 0.4)
  Top 0.203: X3.15 35.77,72.81 v35.81,72.77 39.16,72.77 R24.2 | U2.33 24.48,70.77 24.38,70.87 | 24.38,70.87 24.26,70.99 | 24.26,70.99 v23.88,71.37 | 24.38,70.87 24.38,70.23 | 24.26,70.99 24.26,70.48 24.13,70.36 | 24.51,70.74 24.64,70.61 | 24.64,70.61 24.77,70.48 24.77,70.23 24.77,70.36 24.51,70.61 | 24.38,70.87 24.64,70.61
  Bottom 0.203: v23.88,71.37 24.64,71.37 25.78,72.52 34.8,72.52 35.05,72.77 v35.81,72.77
N$44  (via drill 0.4)
  Top 0.203: R23.2 v37.08,74.42 36.27,75.23 X3.16 | v25.65,69.54 25.6,69.54 U2.34
  Bottom 0.203: v37.08,74.42 37.08,72.39 36.32,71.63 26.16,71.63 25.65,71.12 v25.65,69.54
N$45
  Top 0.203: U2.14 37.89,69.04 38.1,68.83 42.93,68.83 43.56,68.2 R21.2
N$46  (via drill 0.35)
  Top 0.203: U2.28 28.48,71.02 28.07,70.61 25.91,70.61 24.13,72.39 23.37,72.39 22.57,71.59 RN21.4 21.72,71.59 v21.72,69.98 | v28.19,45.72 27.69,45.72 22.99,41.02 22.99,39.24 21.84,38.1 21.84,36.58 21.34,36.07 20.48,36.07 U1.111
  Bottom 0.203: v21.72,69.98 21.72,68.45 20.32,67.06 20.32,48.26 22.86,45.72 v28.19,45.72
N$49
  Top 0.203: RN11.1 40.19,23.81 37.34,20.95 34.89,20.95 U1.69
N$50
  Top 0.203: U3.2 1.78,7.87 1.52,8.13 1.52,9.78 3.17,11.43 R31.1
N$51
  Top 0.203: U1.76 35.08,27.24 35.84,27.24 38.5,29.9 38.5,30.57 RN15.7
N$52
  Top 0.203: R41.2 26.17,5.45 U4.3
N$54
  Top 0.203: 39.88,75.31 37.97,75.31 37.27,76.01 X3.18 | 40.13,75.44 40.39,75.44 | R24.1 41.27,72.39 | 43.14,72.39 F1.2 | R23.1 41.27,74.38 | 40.39,75.69 40.39,75.44 | 40.39,75.69 40.13,75.44 | 40.39,75.69 40.26,75.56 40.51,75.56 | 40.39,75.44 40.64,75.44 | 39.88,75.31 40.01,75.31 40.13,75.44 | 39.88,75.31 40.77,75.31
  Top 0.254: R23.1 41.24,74.84 40.77,75.31 40.64,75.44 40.39,75.69 40.39,79.88 40.7,80.2 D23.2 | 41.27,74.38 41.27,72.39
  Top 0.305: 41.27,72.39 43.14,72.39
N$56
  Top 0.203: U1.72 35.81,23.02 35.81,23.62 37.85,25.65 38.23,26.04 40.06,27.88 40.06,30.06 39.3,30.82 RN15.8
N$57
  Top 0.203: VD3.P$1 63.5,13.84 62.38,14.96 X1.16 50.45,14.96 46.35,19.05 46.35,19.81 44.76,21.41 RN11.5
N$58
  Top 0.203: VD2.P$1 62.87,15.11 62.52,15.46 X1.17 50.58,15.46 46.86,19.18 46.86,20.07 44.72,22.21 RN11.6
N$59
  Top 0.203: VD1.P$1 65.15,16.38 64.73,15.96 X1.18 50.72,15.96 47.37,19.3 47.37,20.32 44.69,23.01 RN11.7
N$60
  Top 0.203: VD0.P$1 65.15,17.65 63.96,16.46 X1.19 50.85,16.46 47.88,19.43 47.88,20.57 44.65,23.81 RN11.8
N$61  (via drill 0.4)
  Top 0.203: 21.08,13.72 18.54,16.26 17.73,16.26 U1.24 | R41.1 21.59,10.03 21.59,11.43 21.08,11.94 21.08,13.08 | 21.72,13.72 24,16 24,19.05 v24.51,19.56 | 21.72,13.72 21.08,13.08 | 21.08,13.08 21.08,13.34 | 21.08,13.34 21.08,13.72 | 21.08,13.72 21.21,13.72 | 21.21,13.72 21.46,13.72 | 21.72,13.72 21.46,13.72 | 21.46,13.72 21.21,13.46 | 21.08,13.34 21.21,13.46 | 21.21,13.46 21.21,13.72 | U1.89 v28.45,29.8
  Bottom 0.203: v28.45,29.8 27.81,29.16 27.81,22.99 24.51,19.68 v24.51,19.56
N$62  (via drill 0.4)
  Top 0.254: v33.4,55.12 33.4,41.02 29.72,37.34 R17.1 28.95,36.66 U1.98
  Bottom 0.254: D1.C 61.47,80.86 61.47,56.39 60.58,55.5 35.05,55.5 34.67,55.12 v33.4,55.12
N$64
  Top 0.203: RN11.2 40.53,23.01 37.97,20.45 34.69,20.45 U1.68
N$65
  Top 0.203: RN12.1 39.17,19.74 38.35,18.92 34.09,18.92 U1.65
N$66
  Top 0.203: RN12.2 39.01,18.94 37.97,17.91 31.57,17.91 U1.60
N$67
  Top 0.203: RN12.3 38.84,18.14 38.1,17.4 33.66,17.4 31.38,17.4 U1.59
N$68
  Top 0.203: RN12.4 38.68,17.34 38.23,16.89 31.18,16.89 U1.58
N$69
  Top 0.203: VD4.P$1 64.14,12.57 62.25,14.46 X1.15 50.31,14.46 45.03,19.74 RN12.8
N$70
  Top 0.203: VD5.P$1 64.77,11.3 62.12,13.96 X1.14 50.18,13.96 45.19,18.94 RN12.7
N$71
  Top 0.203: VD6.P$1 65.15,10.03 61.73,13.46 X1.13 50.04,13.46 45.36,18.14 RN12.6
N$72
  Top 0.203: #VDS.P$1 64.39,8.76 60.69,12.46 X1.11 48.76,12.46 48.13,13.08 48.13,13.84 44.63,17.34 RN12.5
N$73
  Top 0.203: VDCLK.P$1 63.5,7.49 59.53,11.46 X1.9 48.23,11.46 46.61,13.08 46.61,14.22 45.16,15.68 RN13.8
N$74
  Top 0.203: RN13.6 44.47,14.08 48.09,10.46 X1.7 59.27,10.46 63.5,6.22 ALRCLK.P$1
N$75
  Top 0.203: RN13.5 44.51,13.28 47.83,9.96 X1.6 59,9.96 64.01,4.95 ASDATA.P$1
N$76
  Top 0.203: U1.52 32.21,11.61 34.23,11.61 35.31,10.54 36.07,10.54 37.72,10.54 38.79,11.61 RN14.1
N$77
  Top 0.203: RN13.3 39.6,14.08 37.08,11.56 35.81,11.56 34.8,12.57 32.67,12.57 U1.54
N$78
  Top 0.203: U1.53 32.47,12.06 34.54,12.06 35.56,11.05 37.34,11.05 39.57,13.28 RN13.4
N$79
  Top 0.203: RN14.8 44.52,11.61 47.18,8.96 X1.4 58.35,8.96 59.31,8 59.31,4.7 60.33,3.68 ASCLK.P$1
N$80
  Top 0.203: RN14.6 44.98,10.01 47.03,7.96 X1.2 57.15,7.96 57.78,7.32 57.78,3.43 58.8,2.41 CTRL.P$1
N$81
  Top 0.203: RN14.5 44,9.23 45,9.23 46.74,7.49 46.77,7.46 X1.1 56.8,7.46 57.28,6.99 57.28,2.92 59.05,1.15 59.05,1.14 #RST.P$1
N$82
  Top 0.203: RN14.4 35.05,9.21 33.73,10.54 31.87,10.54 U1.50
N$83
  Top 0.203: RN14.3 35.05,10.01 34.05,11.02 32.1,11.02 U1.51
N$84
  Top 0.203: RN11.3 40.37,22.21 38.1,19.94 34.49,19.94 U1.67
N$85
  Top 0.203: U1.8 9.34,19.18 8.89,19.18 4.39,14.68 4.39,11.05 3.12,9.78 U3.1
N$86
  Top 0.203: U3.5 7.75,5.33 7.11,5.97 1.78,5.97 1.02,6.73 1.02,10.16 2.16,11.3 2.16,14.22 3.17,15.24 3.17,17.53 3.56,17.91 6.66,17.91 U1.6
N$87  (via drill 0.4)
  Top 0.203: v10.92,17.53 11.22,17.53 U1.13 | D31.3 v4.28,15.62 3.17,14.52 R31.2
  Bottom 0.203: v4.28,15.62 6.48,15.62 8.38,17.53 v10.92,17.53
N$88
  Top 0.203: U3.6 11.3,6.6 11.94,7.24 11.94,9.91 11.44,10.41 11.44,13.47 10.41,14.49 10.41,15.11 9.4,16.13 9.4,16.64 10.16,17.4 10.16,17.91 10.54,18.29 11.28,18.29 U1.12 11.69,18.68
N$89
  Top 0.203: R33.2 4.83,13.59 4.83,6.99 4.45,6.6 U3.3
N$90
  Top 0.203: U3.7 7.37,7.87 6.6,8.64 6.6,12.32 R32.1
N$91  (via drill 0.4)
  Top 0.203: v61.21,22.1 61.85,22.1 64.26,22.1 64.77,22.61 64.77,26.16 | 64.77,26.16 X4.1 | 64.77,26.16 66.04,27.43 66.04,34.54 65.28,35.31 57.24,35.31 R11.1 | U1.16 14.11,18.29 19.43,18.29 20.95,16.76 v22.73,16.76
  Bottom 0.203: v61.21,22.1 61.21,16.26 56.77,11.81 43.05,11.81 40.64,14.22 29.72,14.22 27.69,16.26 23.24,16.26 v22.73,16.76
N$92  (via drill 0.4)
  Top 0.203: U1.20 15.92,17.27 19.18,17.27 v21.21,15.24 | X4.3 64.77,28.07 64.39,27.69 63.5,26.8 63.5,24.64 63.25,24.38 v63.25,22.86
  Bottom 0.203: v21.21,15.24 27.18,15.24 29.21,13.21 40.39,13.21 42.8,10.79 57.28,10.79 63.25,16.76 v63.25,22.86
N$93  (via drill 0.4)
  Top 0.203: U1.18 15.01,17.78 19.3,17.78 21.08,16 v21.97,16 | v62.23,22.86 62.23,24.38 60.96,25.65 60.96,27.18 61.47,27.69 62.99,27.69 63.5,28.19 63.5,30.23 X4.5 63.5,32.77 56.9,32.77 56.13,33.53 56.13,35.94 56.98,36.79 R12.1
  Bottom 0.203: v62.23,22.86 62.23,16.51 57.02,11.3 42.93,11.3 40.51,13.72 29.46,13.72 27.43,15.75 22.23,15.75 v21.97,16
N$94  (via drill 0.4)
  Top 0.203: v60.45,21.34 64.26,21.34 66.55,23.62 66.55,34.8 X4.9 61.72,39.62 R13.1 | U1.15 13.91,18.8 19.56,18.8 20.57,17.78 v22.73,17.78
  Bottom 0.203: v60.45,21.34 60.45,16.26 56.52,12.32 43.18,12.32 40.77,14.73 29.97,14.73 27.94,16.76 24,16.76 22.99,17.78 v22.73,17.78
N$95
  Top 0.203: RN11.4 40.2,21.41 38.23,19.43 34.29,19.43 U1.66
N$96
  Top 0.203: U1.9 8.98,18.11 R15.2
N$97
  Top 0.203: 10.63,16.22 R14.2 10.89,16.22 11.81,17.14 11.81,17.41 U1.14
N$98
  Top 0.203: U1.92 29.8,33.27 30.73,33.27 32,34.54 32,35.6 R16.1
N$99
  Bottom 0.203: D2.A 58.13,86.27 58.55,85.85 DR2.1
PVDD  (via drill 0.4, 0.5)
  Top 0.203: U2.12 38,68.04 38.04,68.01 37.5,68.54 U2.13
  Top 0.254: C231.1 v38.86,67.82 38.23,67.82 38.04,68.01
  Top 0.305: C23.1 44.51,61.91 43.94,61.34 43.94,58.93 TP_PVDD.TP
  Top 0.813: FB23.2 v45.72,64.52 v45.72,63.37 C23.1
  Bottom 0.254: v45.72,64.52 45.72,66.42 44.32,67.82 v38.86,67.82
  Bottom 0.813: v45.72,64.52 v45.72,63.37
SCL
  Top 0.203: U1.7 10.54,21.08 11.3,21.84 11.3,22.73 10.16,23.88 7.49,23.88 4.57,26.8 4.57,36.32 9.78,41.53 11.05,41.53 19.56,50.04 19.56,59.82 18.92,60.45 18.92,64.77 18.29,65.41 18.29,65.91 18.29,68.07 TP_SCL.TP | TP_SCL.TP 19.56,69.34 21.08,69.34 21.38,69.04 U2.35 | RN21.1 19.37,69.16 TP_SCL.TP
SDA  (via drill 0.35, 0.4)
  Top 0.203: U2.36 v20.47,68.54 19.3,67.38 TP_SDA.TP | U1.10 12.06,20.49 12.06,22.73 10.41,24.38 7.62,24.38 5.08,26.92 5.08,35.81 9.14,39.88 v9.91,40.64 | RN21.3 20.97,70.76 v20.45,70.23
  Bottom 0.203: v9.91,40.64 12.06,40.64 19.81,48.39 19.81,67.89 v20.47,68.54 20.45,68.56 v20.45,70.23
TX_B0
  Top 0.203: U2.62 32.98,57.58 34.54,56.01 34.54,35.05 31.37,31.88 31.37,30.6 U1.86
TX_B1
  Top 0.203: U2.61 32.48,57.24 34.04,55.68 34.04,35.31 30.86,32.13 30.86,30.8 U1.87
TX_B2
  Top 0.203: U2.60 31.98,55.15 32.77,54.36 32.77,41.19 U1.99
TX_B3
  Top 0.203: U2.59 31.48,54.88 32.26,54.1 32.26,41.39 U1.100
TX_B4
  Top 0.203: U1.101 31.75,41.59 31.75,53.85 30.98,54.62 U2.58
TX_B5
  Top 0.203: U1.103 25.4,36.65 25.4,37.47 31.24,43.31 31.24,53.59 30.48,54.36 U2.57
TX_B6
  Top 0.203: U1.105 30.73,43.4 30.73,53.34 29.98,54.1 U2.56
TX_B7
  Top 0.203: U1.106 29.13,42.5 30.23,43.6 30.23,53.09 29.48,53.84 U2.55
TX_CLK  (via drill 0.4)
  Top 0.203: 28.48,57.43 U2.53 | 27.71,56.13 27.71,47.91 18.16,38.35 18.16,37.34 18.16,36.98 U1.113 | 27.71,56.13 27.71,56.67 | 27.71,56.67 28.48,57.43 | v28.19,56.64 27.71,56.16 27.71,56.13 | v28.19,56.64 28.48,56.92 28.48,57.43 | 28.45,57.15 27.81,56.52 27.71,56.61 27.71,56.67 | v28.19,56.64 27.74,56.64 27.71,56.67
  Bottom 0.203: R25.1 v28.19,56.64
TX_G0
  Top 0.203: U2.54 28.98,53.74 28.21,52.98 28.21,47.77 18.67,38.23 18.67,37.18 U1.112
TX_G1
  Top 0.203: U2.52 27.98,58.08 27.21,57.31 27.21,48.04 17.65,38.48 17.65,36.78 U1.114
TX_G2
  Top 0.203: U2.50 26.98,57.71 26.67,57.4 26.67,48.13 17.14,38.61 17.14,36.58 U1.115
TX_G3
  Top 0.203: U2.49 26.2,60.42 26.2,48.3 16.13,38.23 16.13,34.77 U1.119
TX_G4
  Top 0.203: U2.48 24.64,62.23 24.64,48.64 14.1,38.1 14.1,32.56 U1.125
TX_G5
  Top 0.203: U2.47 25.29,63.04 25.63,62.7 25.63,61.95 25.15,61.47 25.15,48.9 25.15,48.51 15.11,38.48 15.11,34.37 U1.121
TX_G6
  Top 0.203: U2.46 25.48,63.54 26.16,62.87 26.16,61.72 25.65,61.21 25.65,48.39 15.62,38.35 15.62,34.57 U1.120
TX_G7
  Top 0.203: U2.45 23.79,64.04 23.5,63.75 23.5,61.72 24.13,61.09 24.13,48.77 11.56,36.2 11.56,30.15 U1.132
TX_R0
  Top 0.203: U2.44 23.65,64.54 22.99,63.88 22.99,61.59 23.62,60.96 23.62,48.9 11.05,36.32 11.05,30.48 11.05,29.95 U1.133
TX_R1
  Top 0.203: U2.43 23.52,65.04 22.48,64.01 22.48,61.47 23.11,60.83 23.11,49.02 10.54,36.45 10.54,29.97 10.54,29.04 U1.135
TX_R2
  Top 0.203: U2.42 23.38,65.54 21.97,64.14 21.97,61.34 22.61,60.71 22.61,49.15 10.03,36.58 10.03,28.84 U1.136
TX_R3
  Top 0.203: U2.41 23.25,66.04 21.46,64.26 21.46,61.21 22.1,60.58 22.1,49.28 9.53,36.7 9.53,28.64 U1.137
TX_R4
  Top 0.203: U2.40 23.11,66.54 20.95,64.39 20.95,61.09 21.59,60.45 21.59,49.4 7.11,34.92 7.11,28.23 U1.141
TX_R5
  Top 0.203: U2.39 22.98,67.04 20.45,64.52 20.45,60.96 21.08,60.33 21.08,49.53 6.6,35.05 6.6,28.03 U1.142
TX_R6
  Top 0.203: U2.38 22.84,67.54 19.94,64.64 19.94,60.83 20.57,60.2 20.57,49.66 6.1,35.18 6.1,27.83 U1.143
TX_R7
  Top 0.203: U2.37 22.7,68.04 19.43,64.77 19.43,60.71 20.07,60.07 20.07,58.93 20.07,49.78 5.59,35.31 5.59,27.42 U1.144
VCC_U4
  Top 0.203: TP_VCC_U4.TP
  Top 0.305: FB41.2 C41.1 32.95,7.2 U4.1 | U4.1 U4.4 | U4.1 TP_VCC_U4.TP
VCCA  (via drill 0.4, 0.5)
  Top 0.203: C161.1 6.57,21.18 7.8,21.18 U1.3 9.23,22.61 v10.03,22.61 | U1.75 33.19,24.64 v33.15,24.64 | U1.107 24.77,38.84 24.77,39.37 24.77,39.82 C164.1 | C16.1 45.4,32.06 45.85,32.51 45.85,40.51 46.35,41.02 54.74,41.02 55.28,40.47 R13.2 R12.2 | U1.96 28.11,34.42 v28.19,34.42 | U1.35 19.3,10.05 19.3,9.27 v20.32,8.26
  Top 0.254: U1.107 22.86,36.94 v22.86,34.67 | C162.1 20.32,8.23 v20.32,8.26
  Top 0.305: 49.66,32.77 50.42,32.77 TP_VCCA.TP | 49.66,32.77 49.02,32.77 v48.26,32 | 49.66,32.77 49.15,33.27
  Top 0.406: v23.88,13.46 25.02,14.61 25.02,18.41 v26.54,19.94
  Top 0.508: U6.5 49.21,34.39 C62.1 49.11,32.85 v48.26,32
  Top 0.813: C16.1 v46.99,32 v48.26,32
  Bottom 0.203: v28.19,34.42 27.56,33.78 | 27.56,33.78 27.43,33.66 27.43,33.53 | 27.18,33.78 27.56,33.78 | 27.56,33.78 27.56,33.4 | v33.15,24.64 33.15,24.51 33.15,24.38
  Bottom 0.305: v22.86,34.67 26.29,34.67 27.18,33.78 27.43,33.53 27.56,33.4 33.15,27.81 33.15,25.78 33.15,25.02 | v10.03,22.61 14.61,18.03 14.61,15.37 20.32,9.65 | C163.1 32.85,24.22 33.15,24.51 | 20.57,8.89 20.83,9.14 | 20.83,9.14 21.08,9.4 20.57,9.4 | 20.57,8.89 20.57,8.51 v20.32,8.26 20.32,9.65 | 20.32,9.65 20.57,9.4 | 20.57,9.4 20.83,9.14 | 20.57,8.89 20.57,9.4 | 20.32,9.65 21.34,9.65
  Bottom 0.406: 32.51,25.15 33.15,25.15 33.15,24.89 v33.15,24.64 | 32.51,25.15 30.99,25.15 29.08,23.24 29.08,22.48 v26.54,19.94 | v23.88,13.46 23.88,12.19 21.34,9.65 21.08,9.4 | 32.51,25.15 33.15,25.78 34.29,24.64 33.91,24.64 33.27,25.27
  Bottom 0.61: 46.99,30.99 46.99,30.1 41.53,24.64 34.29,24.64 33.27,24.64 | 46.99,30.99 v46.99,32 | 46.99,30.99 48.01,32
  Bottom 0.813: v46.99,32 48.01,32 v48.26,32
VCCD_PLL  (via drill 0.4, 0.5)
  Top 0.203: U1.1 7.53,22.86 7.11,22.86 | 7.11,22.86 v5.46,22.86 | 7.11,22.86 7.49,22.48 | U1.37 22.35,10.65 v22.35,12.45 | U1.73 36.7,26.53 v36.7,26.67 | U1.109 21.97,39.59 v21.97,39.62 | 20.7,38.23 20.7,38.35 20.57,38.35 | 20.7,38.23 20.7,37.85 20.57,37.72 20.57,38.35 | 20.57,38.35 20.32,38.35 20.19,38.23 | 20.07,38.1 20.19,38.23 | 20.19,38.23 20.7,38.23
  Top 0.305: U1.109 20.27,37.9 20.07,38.1 | FB11.2 3.6,25.49 TP_VCCD_PLL.TP
  Top 0.813: FB11.2 v2.79,26.67 v2.79,27.94 C15.1
  Bottom 0.203: v5.46,22.86 5.33,22.86 4.87,22.86 C151.1 | v22.35,12.45 22.35,13.12 C152.1 | 37.15,27.11 37.27,27.24 | 37.15,27.11 C153.1 | C153.1 | v21.97,39.62 C154.1 | v36.7,26.67 37.15,27.11
  Bottom 0.305: v22.35,12.45 21.34,11.43 20.07,11.43 15.62,15.88 15.62,19.43 11.18,23.88 10.92,23.88 10.16,23.88 9.65,23.88 8.64,22.86 4.87,22.86 | 37.34,27.3 C153.1 | 37.27,27.24 35.94,28.57 35.94,30.35 37.34,31.75 37.34,33.53 27.43,43.43 25.78,43.43 v21.97,39.62
  Bottom 0.406: v2.79,27.94 2.79,34.8 5.71,37.72 18.8,37.72 20.7,39.62 v21.97,39.62
  Bottom 0.61: v2.79,26.67 2.79,24 3.9,22.9 C151.1
  Bottom 0.813: v2.79,26.67 v2.79,27.94
VCCINT  (via drill 0.4, 0.5)
  Top 0.203: U1.5 8.11,20.07 v7.75,20.07 | U1.29 16.64,11.62 v16.64,11.18 | U1.34 17.78,9.23 v17.78,9.02 | U1.38 24.64,9.29 v24.64,9.27 | U1.45 27.05,11.82 v27.05,11.68 | U1.70 35.22,21.34 36.45,21.34 38.26,23.15 C137.1 | U1.78 32.84,26.42 31.88,26.42 | U1.84 32.64,30.46 v32.64,30.73 | U1.102 26.16,36.71 v26.16,37.21 | U1.116 18.6,34.42 19.3,34.42 v19.94,35.05 | U1.124 15.75,31.61 15.75,30.86 v15.37,30.48 | U1.134 12.35,27.94 v12.83,27.94 | U1.138 11.04,26.42 v11.3,26.42 | U1.61 30.76,19.43 29.34,19.43 v28.89,18.99 | 31.88,26.42 31.75,26.54 | 31.75,26.54 v31.62,26.67 | 31.88,26.42 31.37,25.91 | 31.37,25.91 31.37,25.84 | 31.37,25.91 31.37,26.16 31.75,26.54
  Top 0.254: v31.62,26.67 31.37,26.42 31.37,25.84 31.37,25.18 32.47,24.09 U1.70
  Top 0.406: 27.28,1.34 C52.1 27.14,1.4 TP_VCCINT.TP | TP_VCCINT.TP 22.92,1.4 22.83,1.49 | TP_VCCINT.TP 24.89,2.41
  Top 0.508: U5.5 27.28,1.34
  Top 0.61: 22.44,1.88 C13.1 22.83,1.49 22.88,1.44 23.11,1.44 24.13,2.45 24.13,2.54 v24.13,2.96 | C52.1 26.67,1.44 25.65,2.45 v25.65,2.96 | 24.13,2.41 24.89,2.41 25.65,2.41
  Top 0.813: FB11.1 v2.79,22.61 v2.79,21.34 | v24.13,2.96 v25.65,2.96
  Bottom 0.203: C131.1 7.75,19.81 v7.75,20.07 | v16.64,11.18 C132.1 | C132.1 | C133.1 18.25,8.54 v17.78,9.02 | v24.64,9.27 C134.1 | v27.05,11.68 C135.1 | 31.21,26.07 31.62,26.48 v31.62,26.67 | v32.64,30.73 C139.1 | C139.1 | v26.16,37.21 C140.1 | C140.1 | v19.94,35.05 C141.1 | v15.37,30.48 C142.1 | v12.83,27.94 C143.1 | v11.3,26.42 C144.1 | v28.89,18.99 28.41,19.46 C136.1
  Bottom 0.813: v25.65,2.96 v24.13,2.96 24.13,2.92 22.99,4.06 | 22.99,4.06 19.81,7.24 20.95,7.24 22.99,5.21 | 22.99,5.21 22.99,6.35 | 22.99,6.35 22.99,7.87 | 21.46,7.87 22.99,6.35 | 5.97,21.34 v2.79,21.34 v2.79,22.61 3.68,21.72 5.59,21.72 | 22.99,4.06 22.99,5.21
  pour Bottom (rank 4): 20.07,6.6 23.24,6.6 33.4,16.76 33.4,31.11 26.8,37.72 20.57,37.72 5.33,22.48 5.33,21.34
VCCIO  (via drill 0.35, 0.4, 0.5)
  Top 0.203: R15.1 8.32,16.01 8.32,16 | 8.32,15.56 v8.06,15.3 7.81,15.05 | 8.32,16 8.32,15.75 | 8.32,15.75 8.32,15.56 | R14.1 8.77,15.56 8.76,15.56 | 8.51,15.56 8.32,15.56 | R33.1 7.59,14.82 7.81,15.05 | 7.81,14.8 7.81,15.05 | 7.56,15.05 7.37,15.05 7.65,14.76 | 7.56,15.05 7.81,15.05 | 7.65,14.76 7.81,14.61 7.81,14.8 | 7.81,14.8 7.56,15.05 | 8.32,16 8.76,15.56 | 8.76,15.56 8.51,15.56 | 8.51,15.56 8.32,15.75 | U1.26 15.68,12.79 14.82,12.79 C112.1 | U1.40 25.85,9.49 C113.1 | U1.47 28.26,12.03 C114.1 | U1.81 v34.09,29.79 34.44,30.14 C117.1 | U1.130 12.32,30.8 v12.32,32.64 | U1.139 8.38,28.37 C122.1 | U1.17 v12.23,15.71 11.59,15.06 C111.1 | v33.15,18.67 33.02,18.54 32.35,18.54 U1.62 | U1.117 18.41,33.9 v18.41,33.53 | U1.122 16.77,32 v16.89,32 | 21.08,29.53 21.02,29.59 20.57,29.59 20.51,29.59 | U1.56 30.78,15.88 v31.24,15.88 32.3,15.88 C115.1 | v39.62,6.48 v39.62,7.49 | U1.93 27.06,31.24 26.04,31.24 v25.02,32.26 | R32.2 7.65,14.76 | R16.2 31.71,37.59 v30.99,37.59 30.73,37.34 30.73,35.56 30.35,35.18 29.93,35.18 R17.2 | RN21.6 20.97,74.4 v20.19,75.18 19.88,74.87 19.37,74.36 RN21.8
  Top 0.254: U1.26 17.62,14.73 19.3,14.73 20.57,13.46 20.57,11.81 21.21,11.18 21.21,9.65 22.86,8 22.86,7.24 25.65,4.45 v28.96,4.45 | U5.3 31.81,3.24 31.5,2.92 31.5,1.65 31.81,1.34 U5.1 | v7.62,9.14 U3.8 | 17.02,25.4 16.26,24.64 14.22,24.64 13.21,25.65 11.1,25.65 U1.139 | 17.02,25.4 17.4,25.78 | U1.130 17.02,26.1 17.02,26.16 | 17.78,26.16 17.02,26.16 | 17.02,26.16 17.02,25.4 | 17.02,25.4 17.14,25.53 17.14,25.91 17.27,26.04 17.4,26.04 | 24.26,28.32 24.26,28.45 24.13,28.45 | 23.75,28.96 23.62,28.96 | FB1.2 56.13,26.92 | 22.54,29.78 v25.02,32.26 | 23.11,30.35 23.11,29.46 22.99,29.59 22.99,30.1 | C113.1 26.36,9.91 26.92,9.91 28.96,7.87 v28.96,7.11 | v30.48,9.4 29.72,9.4 28.07,11.05 28.07,11.62 C114.1 | v1.27,14.48 2.08,15.28 D31.2
  Top 0.305: 20.57,28.96 20.51,28.89 17.78,26.16 17.4,25.78 | v16.89,32 17.78,32 | 17.78,32 18.29,32 | 18.29,32 18.41,32 20.51,29.91 20.57,29.84 20.57,29.78 | v18.41,33.53 18.41,32.64 | 18.41,32.64 18.41,32.13 18.29,32 | 17.78,32 18.41,32.64 | 18.41,32.64 18.41,32.38 18.16,32.13 | 20.83,29.21 20.7,29.34 20.7,29.46 | 20.51,29.78 20.51,29.59 | v43.05,76.33 43.56,76.83 59.31,76.83 59.69,76.45 | 59.69,76.45 60.71,75.44 | 60.71,75.44 v62.23,73.91 | 60.45,76.2 v60.45,76.45 59.69,76.45 | 60.45,76.2 60.45,75.69 60.71,75.44 | 59.69,76.45 59.94,76.2 60.45,76.2
  Top 0.406: 55.24,26.92 56.13,26.92 57.02,26.92 | 37.88,5.46 37.88,4.87 37.47,4.45 v28.96,4.45 | 21.02,29.4 20.83,29.21 20.57,28.96 | 20.51,29.59 20.51,29.4 | 20.51,29.4 20.51,28.89 | 21.08,29.46 21.4,29.78 20.57,29.78 20.51,29.78 | 20.51,29.4 20.51,29.84
  Top 0.508: U5.1 35.21,1.34 C51.1 35.34,1.4 38.61,1.4 39.62,2.41 v39.62,5.46 | v30.35,22.23 28.57,24 24.89,27.69 24.13,28.45 23.62,28.96 23.24,29.34 23.11,29.46 22.8,29.78 22.54,29.78 21.4,29.78
  Top 0.61: v39.62,5.46 37.88,5.46 FB41.1 | v62.23,73.91 v62.23,72.9
  Top 0.813: 39.62,7.11 v39.62,7.49 39.62,6.6 39.62,5.84 v39.62,5.46 | v31.37,21.21 v30.35,22.23
  Bottom 0.203: C116.1 33.15,18.16 v33.15,18.67 | v18.41,33.53 C119.1 | v16.89,32 C120.1 | v30.99,37.59 32.51,37.59 36.83,33.27 36.83,32 34.54,29.72 | 34.54,29.72 34.04,29.21 | 34.54,29.72 33.91,29.72 34.04,29.59 34.29,29.59 | v12.32,32.64 12.32,32.71 C121.1
  Bottom 0.254: v7.62,9.14 7.62,9.65 | 7.62,9.65 7.62,10.76 | v8.06,15.3 7.62,14.86 | 7.62,14.86 7.62,14.48 | 7.87,9.14 7.62,8.89 7.62,8.64 8.13,9.14 7.62,9.65 | 7.62,9.65 7.75,9.53 7.75,9.27 | v25.02,32.26 25.08,32.26 C118.1 | DR1.2 62.36,74.04 v62.23,73.91 | v60.45,76.45 58.71,76.45 DR2.2 | v30.48,9.4 28.96,7.87 v28.96,7.11 | 7.62,14.48 7.24,14.48 | 7.24,14.48 v1.27,14.48 | 7.62,14.48 7.62,14.1 | 7.62,14.1 7.62,10.76 | 7.24,14.48 7.62,14.86 | 7.62,14.86 7.62,14.1 | 7.62,14.1 7.24,14.48 | 7.62,10.76 7.62,8.98 7.45,9.14 C31.1
  Bottom 0.305: v39.62,5.46 39.62,2.41 38.61,1.4 22.48,1.4 18.29,5.59 9.65,5.59 7.62,7.62 7.62,8.64 v7.62,9.14 7.87,9.14 8.13,9.14 10.79,9.14 12.19,10.54 12.19,15.71 v12.23,15.71 | v43.05,76.33 40.89,78.49 25.65,78.49 22.35,75.18 v20.19,75.18
  Bottom 0.406: v44.2,28.96 40.89,25.65 34.67,25.65 34.04,26.29 34.04,29.21 34.04,29.73 v34.09,29.79 | 33.15,20.32 v33.15,18.67 31.5,17.02 31.24,16.76 31.24,16.51 v31.24,15.88 | 33.15,20.32 33.15,20.95 33.27,21.08 | v28.96,7.11 28.96,5.84 v28.96,4.45 | 33.91,21.08 33.15,20.32 | 33.15,20.32 32.38,21.08
  Bottom 0.61: v47.5,24.89 48.77,24.89 | 48.77,24.89 64.26,24.89 65.28,23.88 65.28,13.72 59.69,8.13 40.26,8.13 v39.62,7.49 | v47.5,24.89 47.5,25.4 | 47.5,25.4 v47.5,26.16 48.77,24.89 | 44.96,23.62 42.42,21.08 33.91,21.08 33.27,21.08 32.38,21.08 31.37,21.08 v31.37,21.21 | 44.96,23.62 v46.23,24.89 v46.23,26.16 44.96,23.62 | v62.23,73.91 62.23,55.88 60.96,54.61 38.73,54.61 37.72,53.59 37.72,36.7 40.39,34.04 44.7,34.04 46.74,36.07 v51.05,36.07 | 48.77,24.89 48.01,24.89 47.5,25.4 | v47.5,24.89 44.96,23.62
  Bottom 0.813: v39.62,7.49 v39.62,5.46 | v47.5,24.89 47.5,25.4 v47.5,26.16 v46.23,26.16 v47.5,24.89 | v52.32,36.07 v51.05,36.07 | v30.35,22.23 v31.37,21.21 | v45.21,29.97 v44.2,28.96 | v46.23,24.89 v47.5,24.89
  pour Top (rank 2): 56.39,25.4 52.07,25.4 48.01,21.34 43.69,25.65 43.69,30.86 45.97,33.15 45.97,42.42 54.61,42.42 54.61,32 62.99,32 62.99,25.4

## Text on the board
tPlace: borti4938 __/)__/)_ | N64 | AdvancedV2
bPlace: N64Av2_20180913
tNames: D2 | D1 | SCL | SDA | T7 | T1b | +5V | T8- / T11 | GND | GND | T3 | T2 | T1a | T6 | +3.3V | VD6-VD0 | Pinout v3 (reverse) | T4 | Ext.Data | GND | GND | T5
tDocu: IMPORTANT: order PCB with 0.8mm substrate thickness! | PCB (c) 2018 by Peter Bartmann aka borti4938